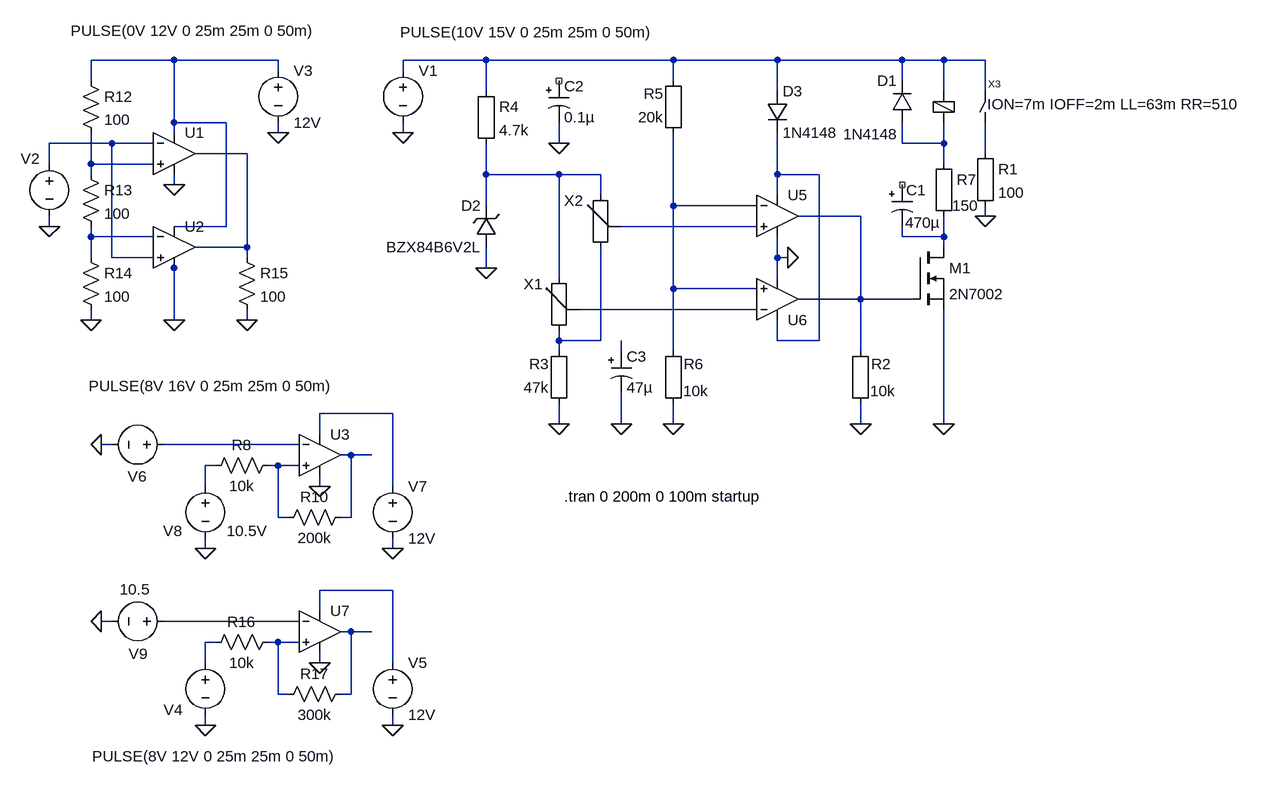
[diagram p0: schematic vin.asc]
vin.asc, the LTspice schematic file:
Version 4
SHEET 1 1764 1232
WIRE -624 -112 -752 -112
WIRE -464 -112 -624 -112
WIRE -144 -112 -272 -112
WIRE 144 -112 -144 -112
WIRE 304 -112 144 -112
WIRE 496 -112 304 -112
WIRE 560 -112 496 -112
WIRE 624 -112 560 -112
WIRE -464 -96 -464 -112
WIRE -272 -96 -272 -112
WIRE -752 -80 -752 -112
WIRE 144 -80 144 -112
WIRE 496 -80 496 -112
WIRE -144 -64 -144 -112
WIRE 304 -64 304 -112
WIRE 560 -64 560 -112
WIRE 624 -64 624 -112
WIRE -624 -16 -624 -112
WIRE -544 -16 -624 -16
WIRE -624 0 -624 -16
WIRE -464 0 -464 -16
WIRE -272 0 -272 -16
WIRE -720 16 -816 16
WIRE -656 16 -720 16
WIRE -32 16 -32 -16
WIRE 496 16 496 -16
WIRE 560 16 560 -16
WIRE 560 16 496 16
WIRE -512 32 -592 32
WIRE 624 32 624 -16
WIRE -816 48 -816 16
WIRE -752 48 -752 0
WIRE -656 48 -752 48
WIRE 560 48 560 16
WIRE -752 64 -752 48
WIRE -144 64 -144 16
WIRE -32 64 -144 64
WIRE 32 64 -32 64
WIRE 304 64 304 0
WIRE 368 64 304 64
WIRE -624 80 -624 64
WIRE 32 96 32 64
WIRE 304 96 304 64
WIRE -144 112 -144 64
WIRE 144 112 144 0
WIRE 272 112 144 112
WIRE 432 128 336 128
WIRE 624 128 624 112
WIRE -816 144 -816 128
WIRE -544 144 -544 -16
WIRE -544 144 -624 144
WIRE 272 144 64 144
WIRE -752 160 -752 144
WIRE -656 160 -752 160
WIRE 496 160 496 144
WIRE 560 160 560 128
WIRE 560 160 496 160
WIRE -512 176 -512 32
WIRE -512 176 -592 176
WIRE 560 176 560 160
WIRE -752 192 -752 160
WIRE -720 192 -720 16
WIRE -656 192 -720 192
WIRE -512 192 -512 176
WIRE 304 192 304 160
WIRE 320 192 304 192
WIRE -624 208 -624 192
WIRE -144 208 -144 176
WIRE -32 224 -32 64
WIRE 304 224 304 192
WIRE 144 240 144 112
WIRE 272 240 144 240
WIRE 432 256 432 128
WIRE 432 256 336 256
WIRE 512 256 432 256
WIRE 272 272 0 272
WIRE -752 288 -752 272
WIRE -624 288 -624 208
WIRE -512 288 -512 272
WIRE -32 320 -32 304
WIRE 32 320 32 176
WIRE 32 320 -32 320
WIRE 304 320 304 288
WIRE 368 320 368 64
WIRE 368 320 304 320
WIRE -32 336 -32 320
WIRE 64 336 64 320
WIRE 144 336 144 240
WIRE 432 336 432 256
WIRE -288 432 -400 432
WIRE -32 448 -32 416
WIRE 64 448 64 400
WIRE 144 448 144 416
WIRE 432 448 432 416
WIRE 560 448 560 272
WIRE -400 464 -400 432
WIRE -720 480 -736 480
WIRE -432 480 -640 480
WIRE -352 496 -368 496
WIRE -320 496 -352 496
WIRE -560 512 -576 512
WIRE -464 512 -480 512
WIRE -432 512 -464 512
WIRE -576 544 -576 512
WIRE -400 544 -400 528
WIRE -288 544 -288 432
WIRE -464 592 -464 512
WIRE -448 592 -464 592
WIRE -352 592 -352 496
WIRE -352 592 -368 592
WIRE -576 640 -576 624
WIRE -288 640 -288 624
WIRE -288 704 -400 704
WIRE -400 736 -400 704
WIRE -720 752 -736 752
WIRE -432 752 -640 752
WIRE -352 768 -368 768
WIRE -320 768 -352 768
WIRE -560 784 -576 784
WIRE -464 784 -480 784
WIRE -432 784 -464 784
WIRE -576 816 -576 784
WIRE -400 816 -400 800
WIRE -288 816 -288 704
WIRE -464 864 -464 784
WIRE -448 864 -464 864
WIRE -352 864 -352 768
WIRE -352 864 -368 864
WIRE -576 912 -576 896
WIRE -288 912 -288 896
FLAG -144 208 0
FLAG -32 16 0
FLAG 144 448 0
FLAG -32 448 0
FLAG -272 0 0
FLAG 64 448 0
FLAG 560 448 0
FLAG 624 128 0
FLAG 320 192 0
FLAG -816 144 0
FLAG -752 288 0
FLAG -624 288 0
FLAG -624 80 0
FLAG -464 0 0
FLAG -512 288 0
FLAG -400 816 0
FLAG -288 912 0
FLAG -576 912 0
FLAG 432 448 0
FLAG -400 544 0
FLAG -288 640 0
FLAG -736 480 0
FLAG -576 640 0
FLAG -736 752 0
SYMBOL Misc\\EuropeanResistor -16 432 R180
WINDOW 0 31 76 Left 2
WINDOW 3 31 40 Left 2
SYMATTR InstName R3
SYMATTR Value 47k
SYMBOL voltage -272 -112 R0
WINDOW 123 0 0 Left 2
WINDOW 39 0 0 Left 2
WINDOW 3 -4 -43 Left 2
SYMATTR Value PULSE(10V 15V 0 25m 25m 0 50m)
SYMATTR InstName V1
SYMBOL pot -48 208 R0
WINDOW 0 -38 25 Left 2
SYMATTR InstName X1
SYMATTR SpiceLine R=100k Val=82
SYMBOL Misc\\EuropeanResistor -160 -80 R0
SYMATTR InstName R4
SYMATTR Value 4.7k
SYMBOL zener -128 176 R180
WINDOW 0 24 64 Left 2
WINDOW 3 24 0 Left 2
SYMATTR InstName D2
SYMATTR Value BZX84B6V2L
SYMATTR Description Diode
SYMATTR Type diode
SYMBOL polcap -48 -80 R0
SYMATTR InstName C2
SYMATTR Value 0.1µ
SYMBOL pot 16 80 R0
WINDOW 0 -40 24 Left 2
SYMATTR InstName X2
SYMATTR SpiceLine R=100k Val=41
SYMBOL Misc\\EuropeanResistor 160 16 R180
WINDOW 0 31 76 Left 2
WINDOW 3 31 40 Left 2
SYMATTR InstName R5
SYMATTR Value 20k
SYMBOL Misc\\EuropeanResistor 160 432 R180
WINDOW 0 -31 76 Left 2
WINDOW 3 -38 35 Left 2
SYMATTR InstName R6
SYMATTR Value 10k
SYMBOL polcap 48 336 R0
SYMATTR InstName C3
SYMATTR Value 47µ
SYMATTR SpiceLine V=16V
SYMBOL diode 288 -64 R0
SYMATTR InstName D3
SYMATTR Value 1N4148
SYMBOL polcap 480 80 R0
WINDOW 0 22 8 Left 2
WINDOW 3 21 58 Left 2
SYMATTR InstName C1
SYMATTR Value 470µ
SYMATTR SpiceLine V=16V
SYMBOL diode 512 -16 R180
WINDOW 0 24 64 Left 2
WINDOW 3 22 -18 Left 2
SYMATTR InstName D1
SYMATTR Value 1N4148
SYMBOL Opamps\\UniversalOpamp2 304 128 R0
SYMATTR InstName U5
SYMBOL Opamps\\UniversalOpamp2 304 256 M180
SYMATTR InstName U6
SYMBOL relais 592 -32 R0
WINDOW 39 35 -12 Left 2
SYMATTR SpiceLine ION=7m IOFF=2m LL=63m RR=510
SYMATTR InstName X3
SYMBOL Opamps\\UniversalOpamp2 -624 32 R0
SYMATTR InstName U1
SYMBOL Opamps\\UniversalOpamp2 -624 176 R0
SYMATTR InstName U2
SYMBOL res -768 -96 R0
SYMATTR InstName R12
SYMATTR Value 100
SYMBOL res -768 48 R0
SYMATTR InstName R13
SYMATTR Value 100
SYMBOL res -768 176 R0
SYMATTR InstName R14
SYMATTR Value 100
SYMBOL voltage -816 32 R0
WINDOW 0 -44 8 Left 2
WINDOW 3 33 -189 Left 2
WINDOW 123 0 0 Left 2
WINDOW 39 0 0 Left 2
SYMATTR InstName V2
SYMATTR Value PULSE(0V 12V 0 25m 25m 0 50m)
SYMBOL voltage -464 -112 R0
WINDOW 123 0 0 Left 2
WINDOW 39 0 0 Left 2
SYMATTR InstName V3
SYMATTR Value 12V
SYMBOL res -528 176 R0
SYMATTR InstName R15
SYMATTR Value 100
SYMBOL voltage -576 800 R0
WINDOW 3 -174 160 Left 2
WINDOW 123 0 0 Left 2
WINDOW 39 0 0 Left 2
WINDOW 0 -64 88 Left 2
SYMATTR Value PULSE(8V 12V 0 25m 25m 0 50m)
SYMATTR InstName V4
SYMBOL Opamps\\UniversalOpamp2 -400 768 R0
SYMATTR InstName U7
SYMBOL res -464 768 R90
WINDOW 0 0 56 VBottom 2
WINDOW 3 32 56 VTop 2
SYMATTR InstName R16
SYMATTR Value 10k
SYMBOL res -352 848 R90
WINDOW 0 0 56 VBottom 2
WINDOW 3 32 56 VTop 2
SYMATTR InstName R17
SYMATTR Value 300k
SYMBOL voltage -288 800 R0
WINDOW 123 0 0 Left 2
WINDOW 39 0 0 Left 2
SYMATTR InstName V5
SYMATTR Value 12V
SYMBOL nmos 512 176 R0
SYMATTR InstName M1
SYMATTR Value 2N7002
SYMBOL Misc\\EuropeanResistor 544 32 R0
WINDOW 3 29 80 Left 2
SYMATTR Value 150
SYMATTR InstName R7
SYMBOL Misc\\EuropeanResistor 608 16 R0
SYMATTR InstName R1
SYMATTR Value 100
SYMBOL res -464 496 R90
WINDOW 0 0 56 VBottom 2
WINDOW 3 32 56 VTop 2
SYMATTR InstName R8
SYMATTR Value 10k
SYMBOL res -352 576 R90
WINDOW 0 0 56 VBottom 2
WINDOW 3 32 56 VTop 2
SYMATTR InstName R10
SYMATTR Value 200k
SYMBOL voltage -288 528 R0
WINDOW 123 0 0 Left 2
WINDOW 39 0 0 Left 2
SYMATTR InstName V7
SYMATTR Value 12V
SYMBOL voltage -624 480 R90
WINDOW 3 -90 -244 VRight 2
WINDOW 123 0 0 Left 2
WINDOW 39 0 0 Left 2
WINDOW 0 49 42 VRight 2
SYMATTR Value PULSE(8V 16V 0 25m 25m 0 50m)
SYMATTR InstName V6
SYMBOL Opamps\\UniversalOpamp2 -400 496 R0
SYMATTR InstName U3
SYMBOL voltage -576 528 R0
WINDOW 3 96 85 Right 2
WINDOW 123 0 0 Left 2
WINDOW 39 0 0 Left 2
WINDOW 0 -65 85 Left 2
SYMATTR Value 10.5V
SYMATTR InstName V8
SYMBOL voltage -624 752 R90
WINDOW 3 -49 84 VLeft 2
WINDOW 123 0 0 Left 2
WINDOW 39 0 0 Left 2
WINDOW 0 50 70 VLeft 2
SYMATTR Value 10.5
SYMATTR InstName V9
SYMBOL Misc\\EuropeanResistor 448 432 R180
WINDOW 0 -31 76 Left 2
WINDOW 3 -38 35 Left 2
SYMATTR InstName R2
SYMATTR Value 10k
TEXT -24 560 Left 2 !.tran 0 200m 0 100m startup

The netlist it stands for:
* vin.asc
R3 0 N016 47k
V1 N002 0 PULSE(10V 15V 0 25m 25m 0 50m)
XX1 N008 N015 N016 pot R=100k Val=82  ; pins 1 2 3
R4 N002 N008 4.7k
D2 0 N008 BZX84B6V2L
C2 NC_01 0 0.1µ
XX2 N008 N012 N016 pot R=100k Val=41  ; pins 1 2 3
R5 N010 N002 20k
R6 0 N010 10k
C3 N017 0 47µ V=16V
D3 N002 N009 1N4148
C1 NC_02 N014 470µ V=16V
D1 N004 N002 1N4148
XU5 N012 N010 N009 0 N011 level.2 Avol=1Meg GBW=10Meg Slew=10Meg ilimit=25m rail=0 Vos=0 phimargin=45 en=0 enk=0 in=0 ink=0 Rin=500Meg  ; pins IN+ IN- V+ V- OUT
XU6 N010 N015 N009 0 N011 level.2 Avol=1Meg GBW=10Meg Slew=10Meg ilimit=25m rail=0 Vos=0 phimargin=45 en=0 enk=0 in=0 ink=0 Rin=500Meg  ; pins IN+ IN- V+ V- OUT
XX3 N002 N004 N002 N006 relais params: ION=7m IOFF=2m LL=63m RR=510  ; pins 1 2 3 4
XU1 N007 N003 N001 0 N005 level.2 Avol=1Meg GBW=10Meg Slew=10Meg ilimit=25m rail=0 Vos=0 phimargin=45 en=0 enk=0 in=0 ink=0 Rin=500Meg  ; pins IN+ IN- V+ V- OUT
XU2 N003 N013 N001 0 N005 level.2 Avol=1Meg GBW=10Meg Slew=10Meg ilimit=25m rail=0 Vos=0 phimargin=45 en=0 enk=0 in=0 ink=0 Rin=500Meg  ; pins IN+ IN- V+ V- OUT
R12 N001 N007 100
R13 N007 N013 100
R14 N013 0 100
V2 N003 0 PULSE(0V 12V 0 25m 25m 0 50m)
V3 N001 0 12V
R15 N005 0 100
V4 N026 0 PULSE(8V 12V 0 25m 25m 0 50m)
XU7 N027 N024 N023 0 N025 level.2 Avol=1Meg GBW=10Meg Slew=10Meg ilimit=25m rail=0 Vos=0 phimargin=45 en=0 enk=0 in=0 ink=0 Rin=500Meg  ; pins IN+ IN- V+ V- OUT
R16 N027 N026 10k
R17 N025 N027 300k
V5 N023 0 12V
M1 N014 N011 0 0 2N7002
R7 N004 N014 150
R1 N006 0 100
R8 N022 N021 10k
R10 N020 N022 200k
V7 N018 0 12V
V6 N019 0 PULSE(8V 16V 0 25m 25m 0 50m)
XU3 N022 N019 N018 0 N020 level.2 Avol=1Meg GBW=10Meg Slew=10Meg ilimit=25m rail=0 Vos=0 phimargin=45 en=0 enk=0 in=0 ink=0 Rin=500Meg  ; pins IN+ IN- V+ V- OUT
V8 N021 0 10.5V
V9 N024 0 10.5
R2 0 N011 10k
.model D D
.lib standard.dio
.model NMOS NMOS
.model PMOS PMOS
.lib standard.mos
.tran 0 200m 0 100m startup
.lib UniversalOpamps2.sub
.backanno
.end